# Altium schematic sheet XX_FPGA.SchDoc
size 840 x 594 mm; ESKD_Decimal_Number: {XXXX.XXXXXX.XXX}; ESKD_Document_Name: {Наименование документа}; ESKD_Pervichnoe_Primenenie: {Первичное наименование}; Address1: Address1; Address2: Address2; Address3: Address3; Address4: Address4; DocumentNumber: АБВГ.123456.001 Э3; SheetNumber: 7; SheetTotal: 7; Scale: 1:1; DocumentType: Схема электрическая принципиальная; FirstReferrence: АБВГ.123456.001
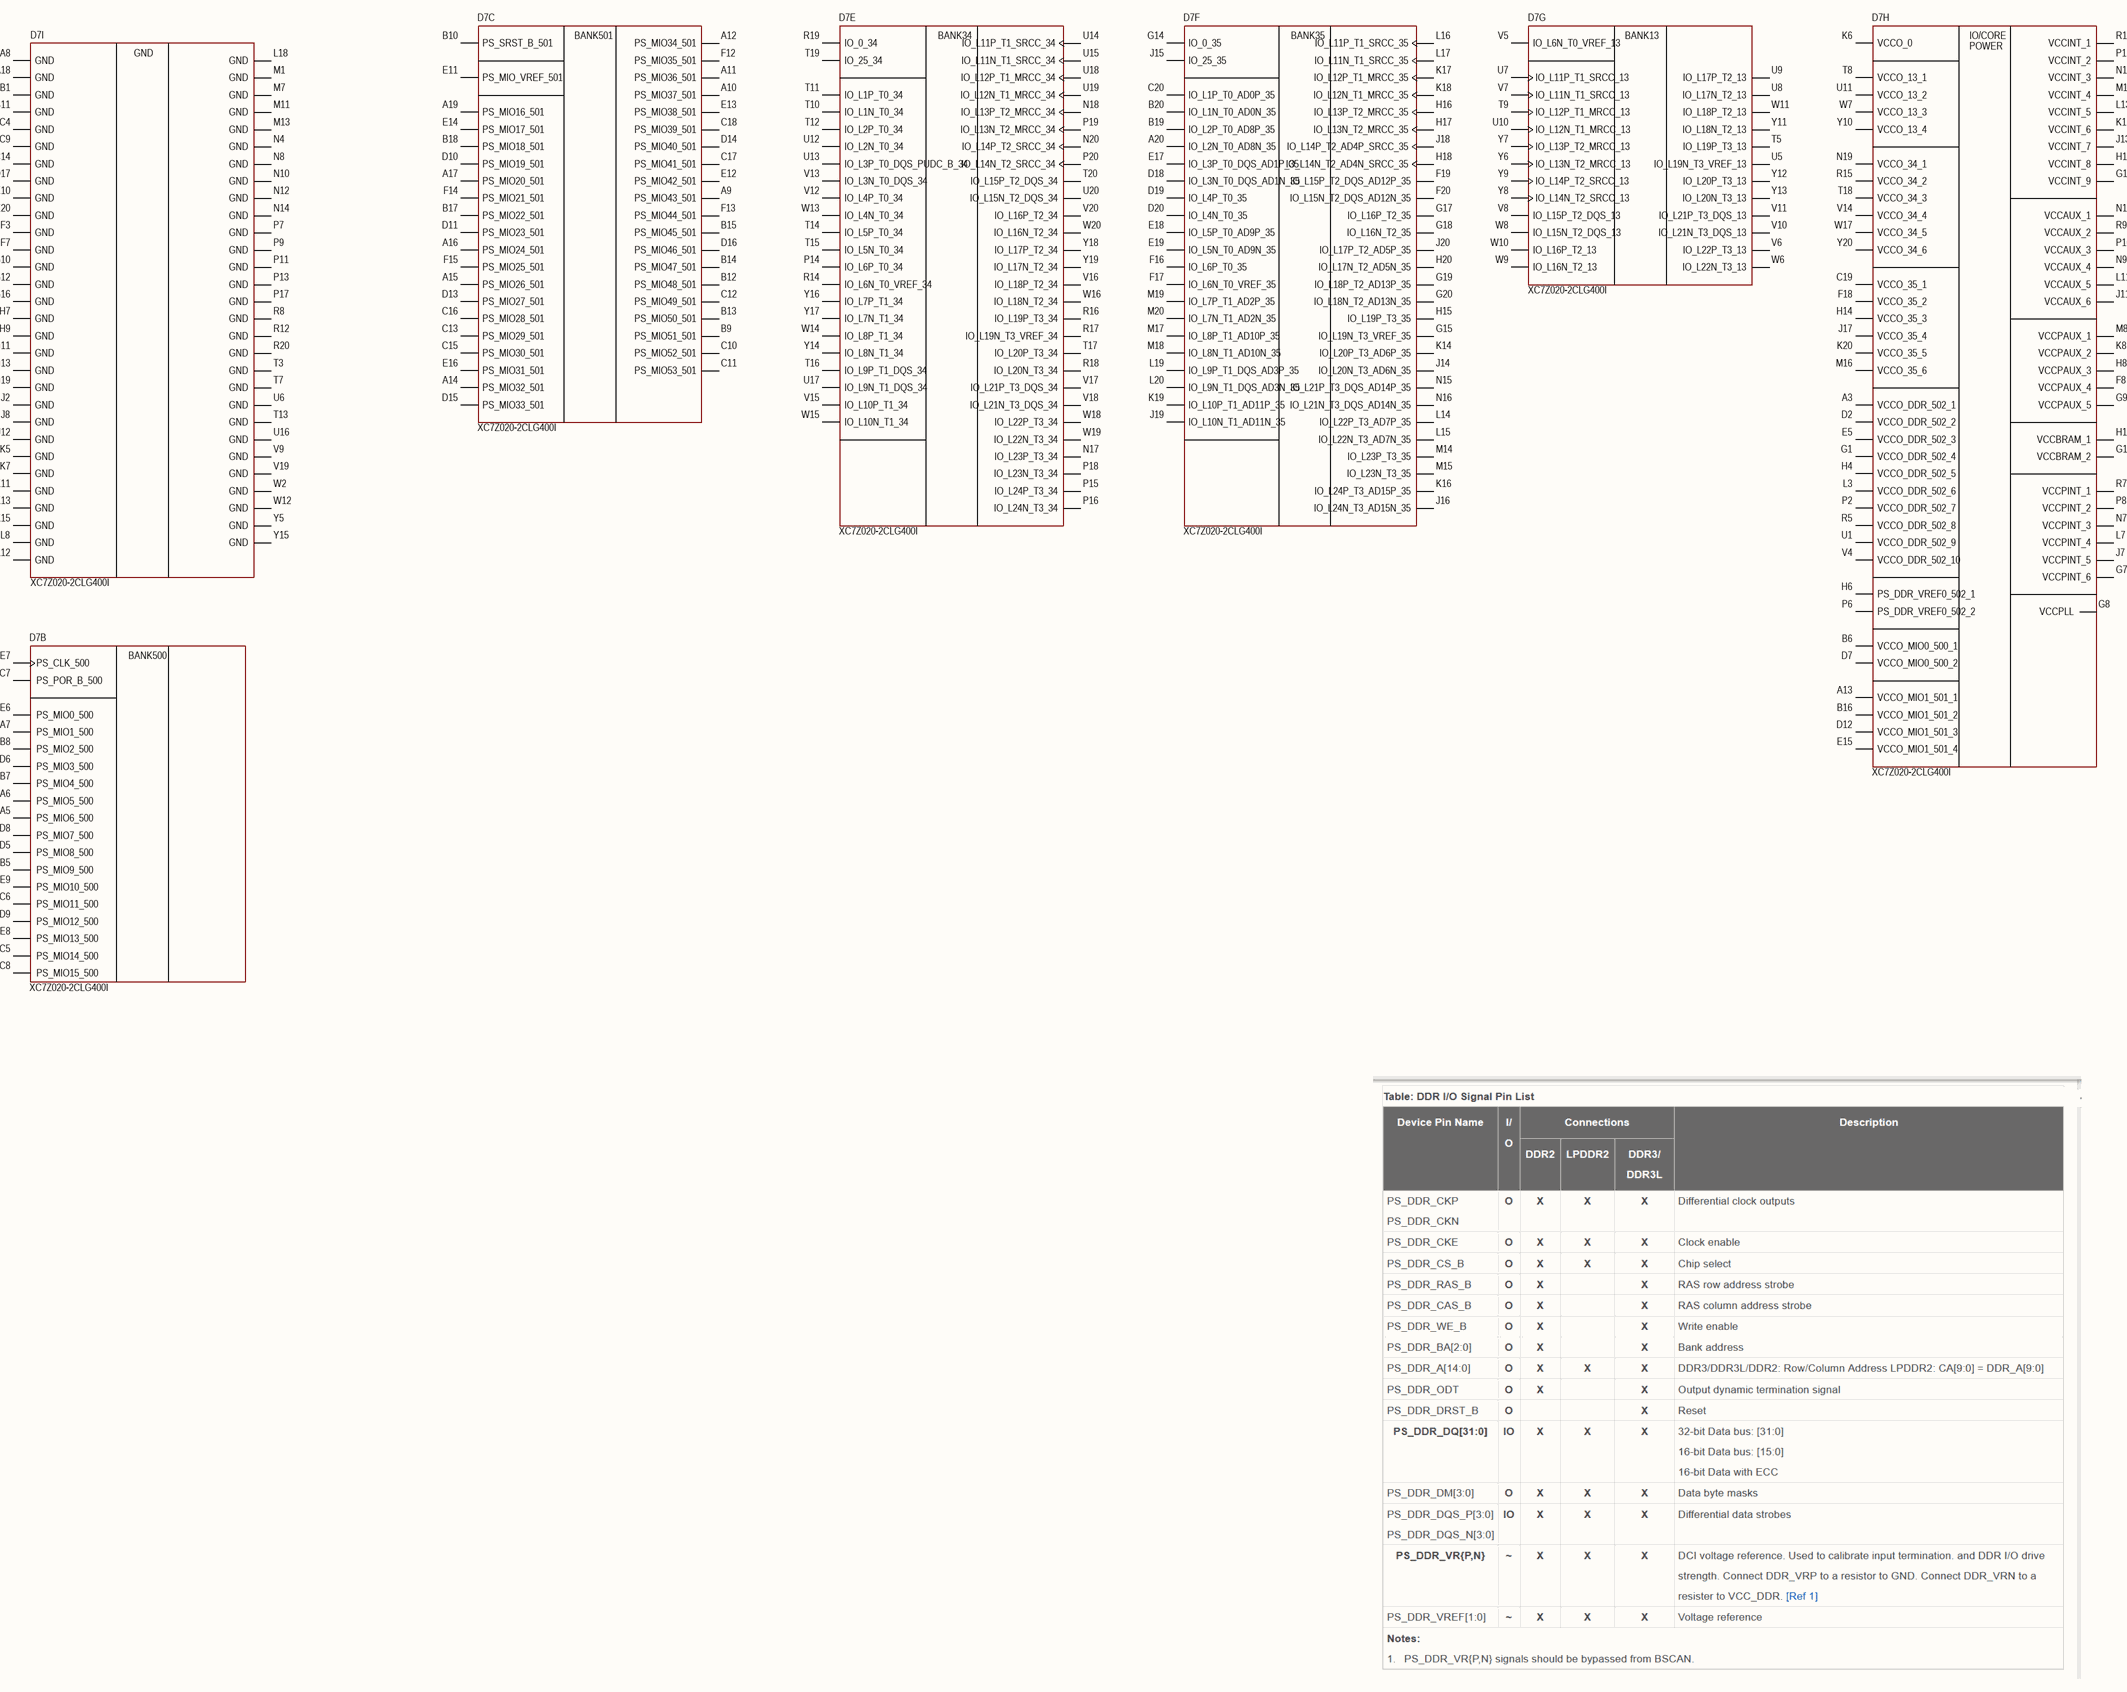
[diagram p0: XX_FPGA.SchDoc]

## Parts
D7  PartNumber: XC7Z020-2CLG400I  [IC:BGA400C80P20X20_1700X1700X147]  (parts B,C,E,F,G,H,I of 9)

## Nets

Not connected (* = marked no-connect by the designer): D7 A3(VCCO_DDR_502_1) A5(PS_MIO6_500) A6(PS_MIO5_500) A7(PS_MIO1_500) A8(GND) A9(PS_MIO43_501) A10(PS_MIO37_501) A11(PS_MIO36_501) A12(PS_MIO34_501) A13(VCCO_MIO1_501_1) A14(PS_MIO32_501) A15(PS_MIO26_501) A16(PS_MIO24_501) A17(PS_MIO20_501) A18(GND) A19(PS_MIO16_501) A20(IO_L2N_T0_AD8N_35) B1(GND) B5(PS_MIO9_500) B6(VCCO_MIO0_500_1) B7(PS_MIO4_500) B8(PS_MIO2_500) B9(PS_MIO51_501) B10(PS_SRST_B_501) B11(GND) B12(PS_MIO48_501) B13(PS_MIO50_501) B14(PS_MIO47_501) B15(PS_MIO45_501) B16(VCCO_MIO1_501_2) B17(PS_MIO22_501) B18(PS_MIO18_501) B19(IO_L2P_T0_AD8P_35) B20(IO_L1N_T0_AD0N_35) C4(GND) C5(PS_MIO14_500) C6(PS_MIO11_500) C7(PS_POR_B_500) C8(PS_MIO15_500) C9(GND) C10(PS_MIO52_501) C11(PS_MIO53_501) C12(PS_MIO49_501) C13(PS_MIO29_501) C14(GND) C15(PS_MIO30_501) C16(PS_MIO28_501) C17(PS_MIO41_501) C18(PS_MIO39_501) C19(VCCO_35_1) C20(IO_L1P_T0_AD0P_35) D2(VCCO_DDR_502_2) D5(PS_MIO8_500) D6(PS_MIO3_500) D7(VCCO_MIO0_500_2) D8(PS_MIO7_500) D9(PS_MIO12_500) D10(PS_MIO19_501) D11(PS_MIO23_501) D12(VCCO_MIO1_501_3) D13(PS_MIO27_501) D14(PS_MIO40_501) D15(PS_MIO33_501) D16(PS_MIO46_501) D17(GND) D18(IO_L3N_T0_DQS_AD1N_35) D19(IO_L4P_T0_35) D20(IO_L4N_T0_35) E5(VCCO_DDR_502_3) E6(PS_MIO0_500) E7(PS_CLK_500) E8(PS_MIO13_500) E9(PS_MIO10_500) E10(GND) E11(PS_MIO_VREF_501) E12(PS_MIO42_501) E13(PS_MIO38_501) E14(PS_MIO17_501) E15(VCCO_MIO1_501_4) E16(PS_MIO31_501) E17(IO_L3P_T0_DQS_AD1P_35) E18(IO_L5P_T0_AD9P_35) E19(IO_L5N_T0_AD9N_35) E20(GND) F3(GND) F7(GND) F8(VCCPAUX_4) F12(PS_MIO35_501) F13(PS_MIO44_501) F14(PS_MIO21_501) F15(PS_MIO25_501) F16(IO_L6P_T0_35) F17(IO_L6N_T0_VREF_35) F18(VCCO_35_2) F19(IO_L15P_T2_DQS_AD12P_35) F20(IO_L15N_T2_DQS_AD12N_35) G1(VCCO_DDR_502_4) G7(VCCPINT_6) G8(VCCPLL) G9(VCCPAUX_5) G10(GND) G11(VCCBRAM_2) G12(GND) G13(VCCINT_9) G14(IO_0_35) G15(IO_L19N_T3_VREF_35) G16(GND) G17(IO_L16P_T2_35) G18(IO_L16N_T2_35) G19(IO_L18P_T2_AD13P_35) G20(IO_L18N_T2_AD13N_35) H4(VCCO_DDR_502_5) H6(PS_DDR_VREF0_502_1) H7(GND) H8(VCCPAUX_3) H9(GND) H10(VCCBRAM_1) H11(GND) H12(VCCINT_8) H13(GND) H14(VCCO_35_3) H15(IO_L19P_T3_35) H16(IO_L13P_T2_MRCC_35) H17(IO_L13N_T2_MRCC_35) H18(IO_L14N_T2_AD4N_SRCC_35) H19(GND) H20(IO_L17N_T2_AD5N_35) J2(GND) J7(VCCPINT_5) J8(GND) J11(VCCAUX_6) J12(GND) J13(VCCINT_7) J14(IO_L20N_T3_AD6N_35) J15(IO_25_35) J16(IO_L24N_T3_AD15N_35) J17(VCCO_35_4) J18(IO_L14P_T2_AD4P_SRCC_35) J19(IO_L10N_T1_AD11N_35) J20(IO_L17P_T2_AD5P_35) K5(GND) K6(VCCO_0) K7(GND) K8(VCCPAUX_2) K11(GND) K12(VCCINT_6) K13(GND) K14(IO_L20P_T3_AD6P_35) K15(GND) K16(IO_L24P_T3_AD15P_35) K17(IO_L12P_T1_MRCC_35) K18(IO_L12N_T1_MRCC_35) K19(IO_L10P_T1_AD11P_35) K20(VCCO_35_5) L3(VCCO_DDR_502_6) L7(VCCPINT_4) L8(GND) L11(VCCAUX_5) L12(GND) L13(VCCINT_5) L14(IO_L22P_T3_AD7P_35) L15(IO_L22N_T3_AD7N_35) L16(IO_L11P_T1_SRCC_35) L17(IO_L11N_T1_SRCC_35) L18(GND) L19(IO_L9P_T1_DQS_AD3P_35) L20(IO_L9N_T1_DQS_AD3N_35) M1(GND) M7(GND) M8(VCCPAUX_1) M11(GND) M12(VCCINT_4) M13(GND) M14(IO_L23P_T3_35) M15(IO_L23N_T3_35) M16(VCCO_35_6) M17(IO_L8P_T1_AD10P_35) M18(IO_L8N_T1_AD10N_35) M19(IO_L7P_T1_AD2P_35) M20(IO_L7N_T1_AD2N_35) N4(GND) N7(VCCPINT_3) N8(GND) N9(VCCAUX_4) N10(GND) N11(VCCAUX_1) N12(GND) N13(VCCINT_3) N14(GND) N15(IO_L21P_T3_DQS_AD14P_35) N16(IO_L21N_T3_DQS_AD14N_35) N17(IO_L23P_T3_34) N18(IO_L13P_T2_MRCC_34) N19(VCCO_34_1) N20(IO_L14P_T2_SRCC_34) P2(VCCO_DDR_502_7) P6(PS_DDR_VREF0_502_2) P7(GND) P8(VCCPINT_2) P9(GND) P10(VCCAUX_3) P11(GND) P12(VCCINT_2) P13(GND) P14(IO_L6P_T0_34) P15(IO_L24P_T3_34) P16(IO_L24N_T3_34) P17(GND) P18(IO_L23N_T3_34) P19(IO_L13N_T2_MRCC_34) P20(IO_L14N_T2_SRCC_34) R5(VCCO_DDR_502_8) R7(VCCPINT_1) R8(GND) R9(VCCAUX_2) R12(GND) R13(VCCINT_1) R14(IO_L6N_T0_VREF_34) R15(VCCO_34_2) R16(IO_L19P_T3_34) R17(IO_L19N_T3_VREF_34) R18(IO_L20N_T3_34) R19(IO_0_34) R20(GND) T3(GND) T5(IO_L19P_T3_13) T7(GND) T8(VCCO_13_1) T9(IO_L12P_T1_MRCC_13) T10(IO_L1N_T0_34) T11(IO_L1P_T0_34) T12(IO_L2P_T0_34) T13(GND) T14(IO_L5P_T0_34) T15(IO_L5N_T0_34) T16(IO_L9P_T1_DQS_34) T17(IO_L20P_T3_34) T18(VCCO_34_3) T19(IO_25_34) T20(IO_L15P_T2_DQS_34) U1(VCCO_DDR_502_9) U5(IO_L19N_T3_VREF_13) U6(GND) U7(IO_L11P_T1_SRCC_13) U8(IO_L17N_T2_13) U9(IO_L17P_T2_13) U10(IO_L12N_T1_MRCC_13) U11(VCCO_13_2) U12(IO_L2N_T0_34) U13(IO_L3P_T0_DQS_PUDC_B_34) U14(IO_L11P_T1_SRCC_34) U15(IO_L11N_T1_SRCC_34) U16(GND) U17(IO_L9N_T1_DQS_34) U18(IO_L12P_T1_MRCC_34) U19(IO_L12N_T1_MRCC_34) U20(IO_L15N_T2_DQS_34) V4(VCCO_DDR_502_10) V5(IO_L6N_T0_VREF_13) V6(IO_L22P_T3_13) V7(IO_L11N_T1_SRCC_13) V8(IO_L15P_T2_DQS_13) V9(GND) V10(IO_L21N_T3_DQS_13) V11(IO_L21P_T3_DQS_13) V12(IO_L4P_T0_34) V13(IO_L3N_T0_DQS_34) V14(VCCO_34_4) V15(IO_L10P_T1_34) V16(IO_L18P_T2_34) V17(IO_L21P_T3_DQS_34) V18(IO_L21N_T3_DQS_34) V19(GND) V20(IO_L16P_T2_34) W2(GND) W6(IO_L22N_T3_13) W7(VCCO_13_3) W8(IO_L15N_T2_DQS_13) W9(IO_L16N_T2_13) W10(IO_L16P_T2_13) W11(IO_L18P_T2_13) W12(GND) W13(IO_L4N_T0_34) W14(IO_L8P_T1_34) W15(IO_L10N_T1_34) W16(IO_L18N_T2_34) W17(VCCO_34_5) W18(IO_L22P_T3_34) W19(IO_L22N_T3_34) W20(IO_L16N_T2_34) Y5(GND) Y6(IO_L13N_T2_MRCC_13) Y7(IO_L13P_T2_MRCC_13) Y8(IO_L14N_T2_SRCC_13) Y9(IO_L14P_T2_SRCC_13) Y10(VCCO_13_4) Y11(IO_L18N_T2_13) Y12(IO_L20P_T3_13) Y13(IO_L20N_T3_13) Y14(IO_L8N_T1_34) Y15(GND) Y16(IO_L7P_T1_34) Y17(IO_L7N_T1_34) Y18(IO_L17P_T2_34) Y19(IO_L17N_T2_34) Y20(VCCO_34_6)

## Notes on the sheet
- Перв. примен.
- Справ. №
- Подп. и дата
- Инв. № дубл.
- Взам. инв. №
- Инв. № подл.
- Изм.
- Лист
- № докум.
- Подп.
- Дата
- 2.106-A2
- Копировал
- Формат А1
- (in symbol XC7Z020_CLG400ABX22, part B) BANK500
- (in symbol XC7Z020_CLG400ABX22, part C) BANK501
- (in symbol XC7Z020_CLG400ABX22, part E) BANK34
- (in symbol XC7Z020_CLG400ABX22, part F) BANK35
- (in symbol XC7Z020_CLG400ABX22, part G) BANK13
- (in symbol XC7Z020_CLG400ABX22, part H) IO/CORE; POWER

## Library data of the parts
D7 = XC7Z020_CLG400ABX22: FPGA XILINX Zynq XC7Z020; Manufacturer: AMD/XILINX; ValueManufacturerPartNumber: IC FPGA, Zynq, , , , 1.15...1.25V, 0...+85°C, CSPBGA-400; Supply: 1.15...1.25V; HelpURL: https://www.lcsc.com/product-detail/Programmable-Logic-Device-CPLDs-FPGAs_AMD-XILINX-XC7Z020-2CLG400I_C569043.html; Package: CSPBGA-400; ComponentType: IC FPGA; Temperature: 0...+85°C; Series: Zynq